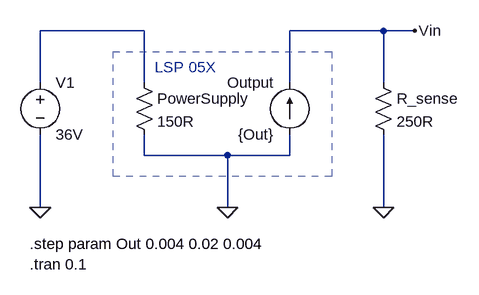
[diagram p0: schematic level.asc]
level.asc, the LTspice schematic file:
Version 4
SHEET 1 1016 680
WIRE 384 16 224 16
WIRE 752 16 608 16
WIRE 800 16 752 16
WIRE 224 96 224 16
WIRE 384 96 384 16
WIRE 608 96 608 16
WIRE 752 96 752 16
WIRE 384 208 384 176
WIRE 512 208 384 208
WIRE 608 208 608 176
WIRE 608 208 512 208
WIRE 224 288 224 176
WIRE 512 288 512 208
WIRE 752 288 752 176
FLAG 800 16 Vin
FLAG 512 288 0
FLAG 752 288 0
FLAG 224 288 0
SYMBOL voltage 224 80 R0
SYMATTR InstName V1
SYMATTR Value 36V
SYMBOL res 368 80 R0
SYMATTR InstName PowerSupply
SYMATTR Value 150R
SYMBOL current 608 176 R180
WINDOW 0 24 80 Left 2
WINDOW 3 24 0 Left 2
SYMATTR InstName Output
SYMATTR Value {Out}
SYMBOL res 736 80 R0
SYMATTR InstName R_sense
SYMATTR Value 250R
TEXT 208 344 Left 2 !.step param Out 0.004 0.02 0.004
TEXT 208 376 Left 2 !.tran 0.1
TEXT 400 72 Left 2 ;LSP 05X
RECTANGLE Normal 672 240 336 48 2

The netlist it stands for:
* level.asc
V1 N001 0 36V
R§PowerSupply N001 0 150R
I§Output 0 Vin {Out}
R_sense Vin 0 250R
.step param Out 0.004 0.02 0.004
.tran 0.1
* LSP 05X
.backanno
.end